# EAGLE schematic Mouse-Schematic copy (EAGLE 9.6.2)
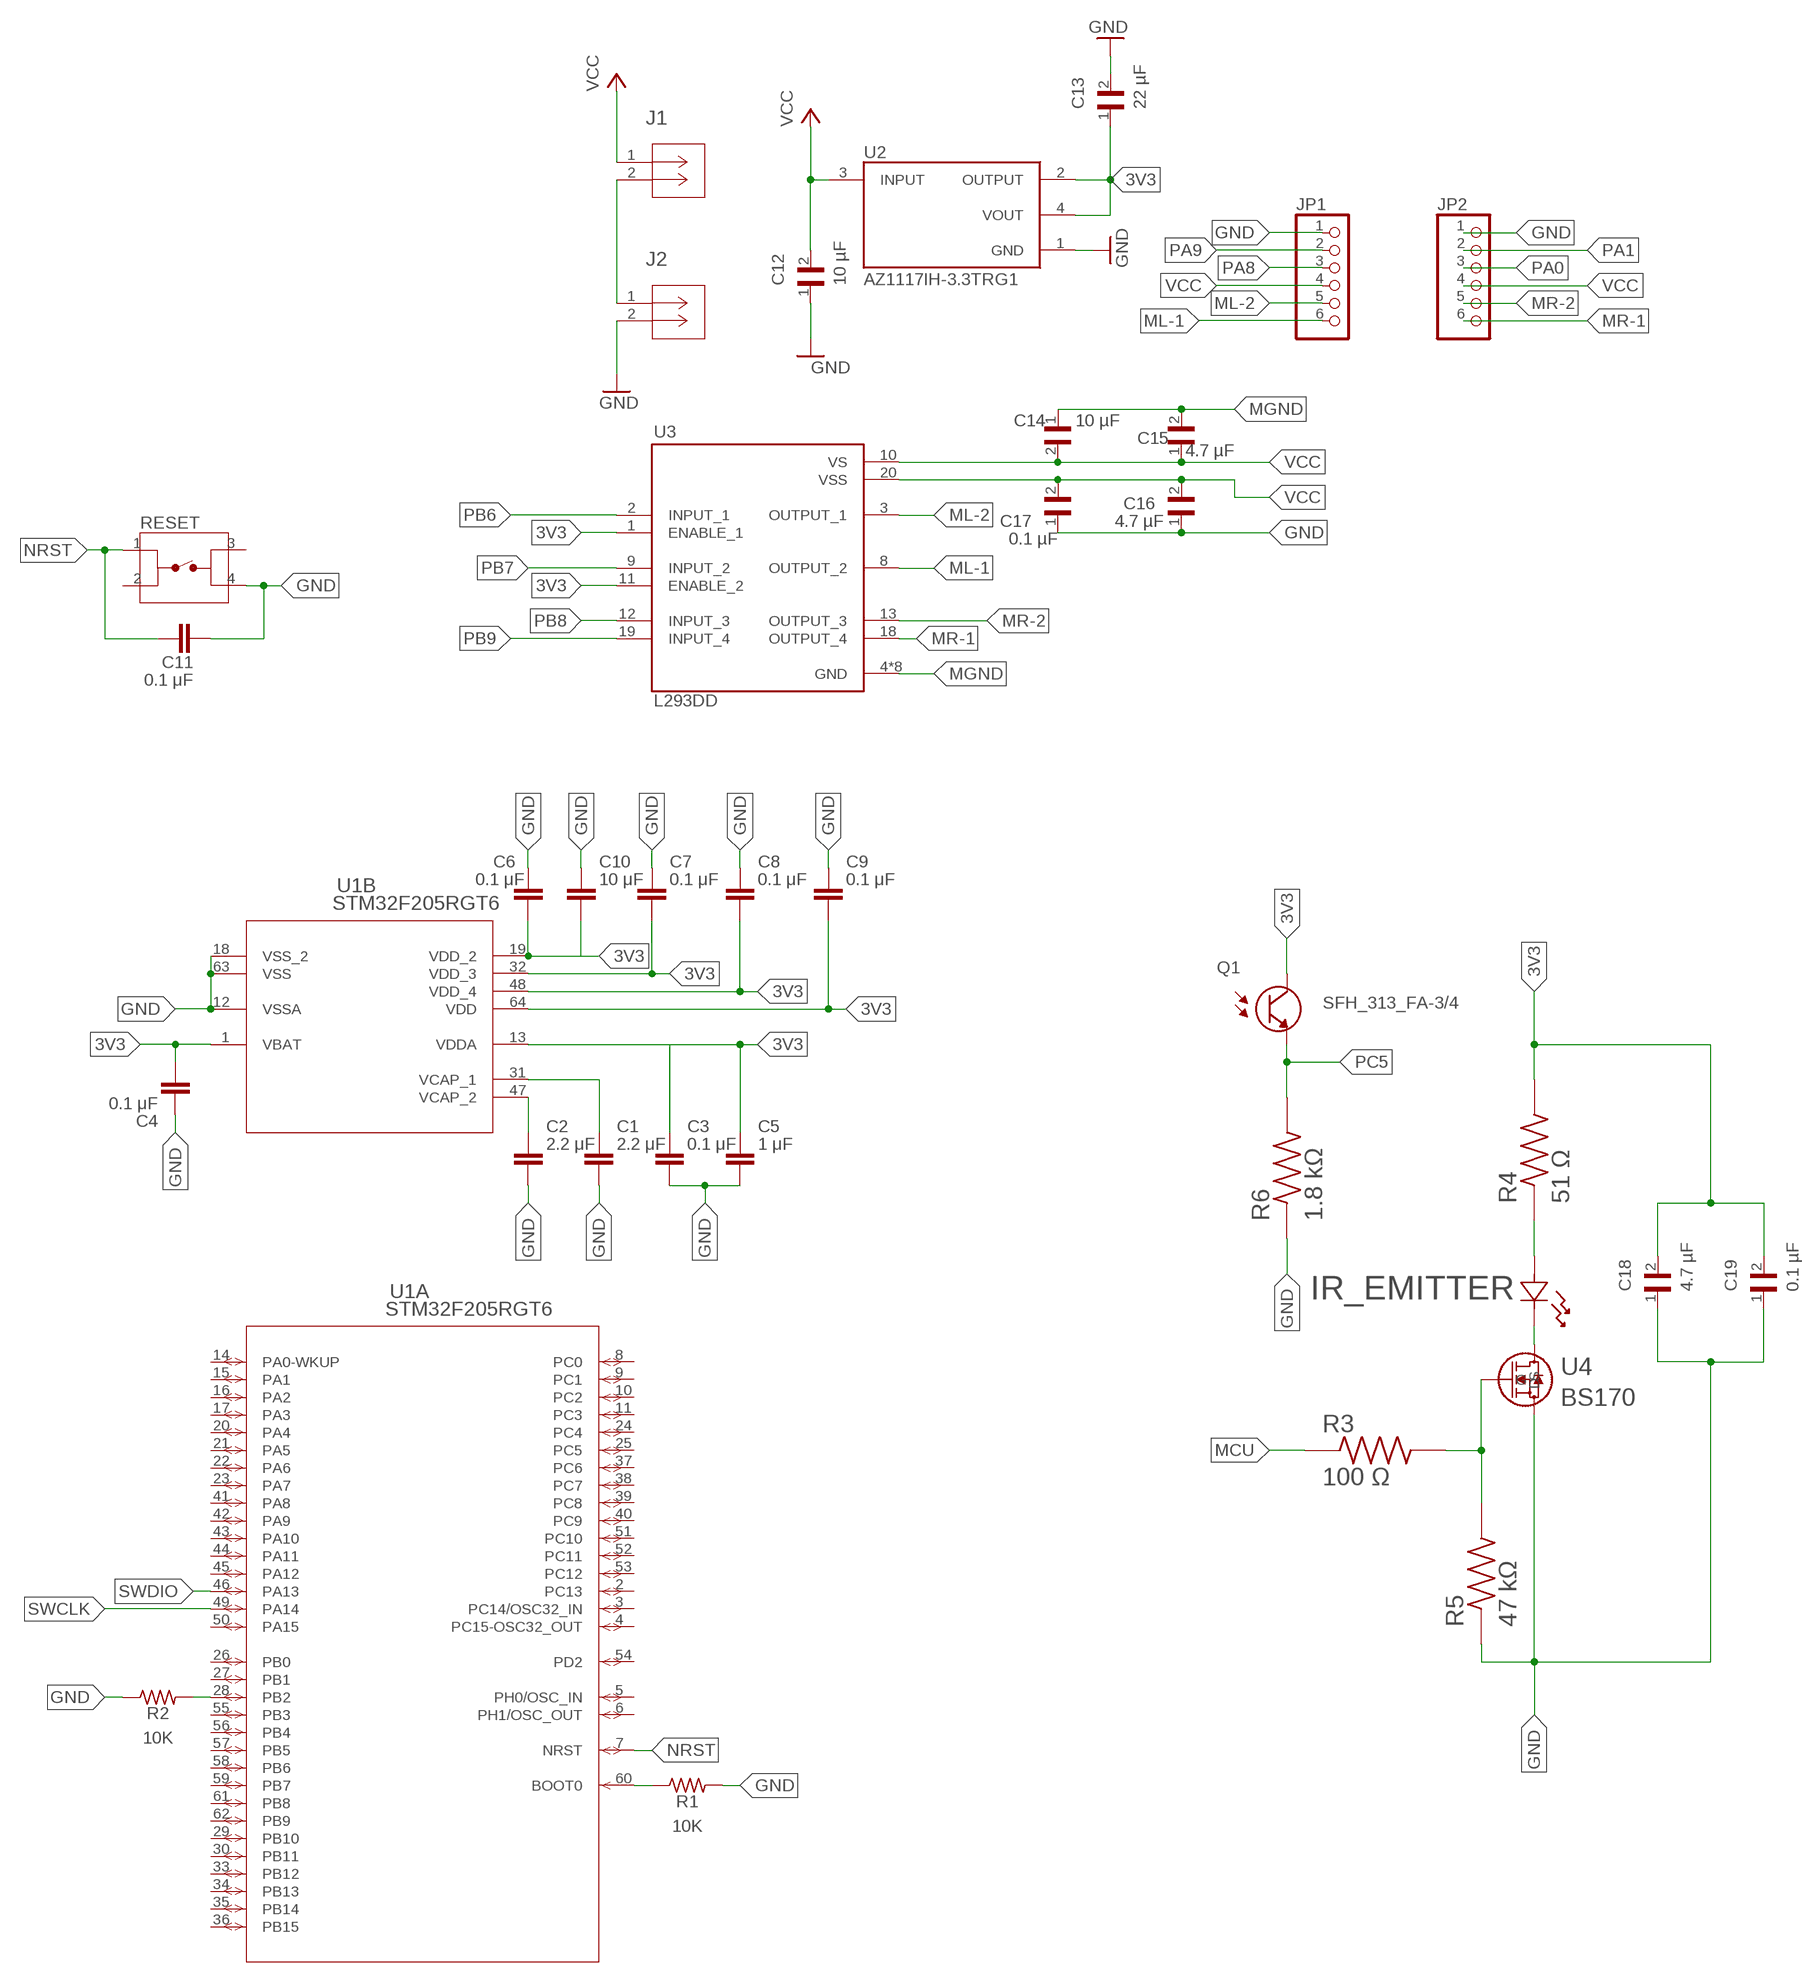
[diagram p0: schematic, sheet 1]

## Parts
C1  2.2 μF  C_CHIP-0603(1608-METRIC)  [CAPC1608X85]
C2  2.2 μF  C_CHIP-0603(1608-METRIC)  [CAPC1608X85]
C3  0.1 μF  C_CHIP-0603(1608-METRIC)  [CAPC1608X85]
C4  0.1 μF  C_CHIP-0603(1608-METRIC)  [CAPC1608X85]
C5  1 μF  C_CHIP-0603(1608-METRIC)  [CAPC1608X85]
C6  0.1 μF  C_CHIP-0603(1608-METRIC)  [CAPC1608X85]
C7  0.1 μF  C_CHIP-0603(1608-METRIC)  [CAPC1608X85]
C8  0.1 μF  C_CHIP-0603(1608-METRIC)  [CAPC1608X85]
C9  0.1 μF  C_CHIP-0603(1608-METRIC)  [CAPC1608X85]
C10  10 μF  C_CHIP-0603(1608-METRIC)  [CAPC1608X85]
C11  0.1 μF  C_CHIP-0603(1608-METRIC)  [CAPC1608X85]
C12  10 µF  GRM21BR61C106KE15L  [CAPC2012X135N]
C13  22 µF  GRM21BR61C226ME44L  [CAPC2012X145N]
C14  10 µF  GRM21BR61C106KE15L  [CAPC2012X135N]
C15  4.7 µF  GRM21BR71C475KE51L  [CAPC2012X140N]
C16  4.7 µF  GRM21BR71C475KE51L  [CAPC2012X140N]
C17  0.1 µF  GCM21BR72A104KA37K  [CAPC2012X140N]
C18  4.7 µF  GRM21BR71C475KE51L  [CAPC2012X140N]
C19  0.1 µF  GCM21BR72A104KA37K  [CAPC2012X140N]
J1  B2B-PH-K-S  [CONN2_B2B-PH-K-S_JST]
J2  B2B-PH-K-S  [CONN2_B2B-PH-K-S_JST]
JP1  PINHD-1X6  [1X06]
JP2  PINHD-1X6  [1X06]
LED1  IR_EMITTER  INL-5AMIR15  [LED_INL-5AMIR15_INO]
Q1  SFH_313_FA-3/4  [XDCR_SFH_313_FA-3/4]
R1  10K  R-US_CHIP-0603(1608-METRIC)  [RESC1608X60]
R2  10K  R-US_CHIP-0603(1608-METRIC)  [RESC1608X60]
R3  100 Ω  CRCW0805100RFKEAHP  [RESC2012X60N]
R4  51 Ω  CRCW080551R0FKEAHP  [RESC2012X60N]
R5  47 kΩ  CRCW080547K0JNEA  [RESC2012X50N]
R6  1.8 kΩ  CRCW08051K80FKEB  [RESC2012X50N]
RESET  FSM4JSMA  [TE_FSM4JSMA]
U1  STM32F205RGT6  [LQFP64-10X10MM]
U2  AZ1117IH-3.3TRG1  [SOT230P700X185-4N]
U3  L293DD  [SOIC127P1032X265-20N]
U4  BS170  [TO_SA06_ONS]

## Nets
3V3: C3.1 C4.2 C5.1 C6.2 C7.2 C8.2 C9.2 C10.2 C13.1 C18.2 C19.2 Q1.2(C) R4.2 U1.1(B:VBAT) U1.13(B:VDDA) U1.19(B:VDD_2) U1.32(B:VDD_3) U1.48(B:VDD_4) U1.64(B:VDD) U2.2(OUTPUT) U2.4(VOUT) U3.1(ENABLE_1) U3.11(ENABLE_2)
GND: C1.2 C2.2 C3.2 C4.1 C5.2 C6.1 C7.1 C8.1 C9.1 C10.1 C11.2 C12.1 C13.2 C16.1 C17.1 C18.1 C19.1 J2.2 JP1.1 JP2.1 R1.2 R2.1 R5.1 R6.1 RESET.4 U1.12(B:VSSA) U1.18(B:VSS_2) U1.63(B:VSS) U2.1(GND) U4.3(S)
MCU: R3.1
MGND: C14.1 C15.2 U3.4(GND) U3.5(GND) U3.6(GND) U3.7(GND) U3.14(GND) U3.15(GND) U3.16(GND) U3.17(GND)
ML-1: JP1.6 U3.8(OUTPUT_2)
ML-2: JP1.5 U3.3(OUTPUT_1)
MR-1: JP2.6 U3.18(OUTPUT_4)
MR-2: JP2.5 U3.13(OUTPUT_3)
N$1: C1.1 U1.31(B:VCAP_1)
N$2: C2.1 U1.47(B:VCAP_2)
N$3: R1.1 U1.60(A:BOOT0)
N$4: R2.2 U1.28(A:PB2)
N$5: J1.2 J2.1
N$6: R3.2 R5.2 U4.1(G)
N$7: LED1.1 U4.2(D)
N$8: LED1.2 R4.1
NRST: C11.1 RESET.1 U1.7(A:NRST)
PA0: JP2.3
PA1: JP2.2
PA8: JP1.3
PA9: JP1.2
PB6: U3.2(INPUT_1)
PB7: U3.9(INPUT_2)
PB8: U3.12(INPUT_3)
PB9: U3.19(INPUT_4)
PC5: Q1.1(E) R6.2
SWCLK: U1.49(A:PA14)
SWDIO: U1.46(A:PA13)
VCC: C12.2 C14.2 C15.1 C16.2 C17.2 J1.1 JP1.4 JP2.4 U2.3(INPUT) U3.10(VS) U3.20(VSS)
Unconnected: RESET.2 RESET.3 U1.2(A:PC13) U1.3(A:PC14/OSC32_IN) U1.4(A:PC15-OSC32_OUT) U1.5(A:PH0/OSC_IN) U1.6(A:PH1/OSC_OUT) U1.8(A:PC0) U1.9(A:PC1) U1.10(A:PC2) U1.11(A:PC3) U1.14(A:PA0-WKUP) U1.15(A:PA1) U1.16(A:PA2) U1.17(A:PA3) U1.20(A:PA4) U1.21(A:PA5) U1.22(A:PA6) U1.23(A:PA7) U1.24(A:PC4) U1.25(A:PC5) U1.26(A:PB0) U1.27(A:PB1) U1.29(A:PB10) U1.30(A:PB11) U1.33(A:PB12) U1.34(A:PB13) U1.35(A:PB14) U1.36(A:PB15) U1.37(A:PC6) U1.38(A:PC7) U1.39(A:PC8) U1.40(A:PC9) U1.41(A:PA8) U1.42(A:PA9) U1.43(A:PA10) U1.44(A:PA11) U1.45(A:PA12) U1.50(A:PA15) U1.51(A:PC10) U1.52(A:PC11) U1.53(A:PC12) U1.54(A:PD2) U1.55(A:PB3) U1.56(A:PB4) U1.57(A:PB5) U1.58(A:PB6) U1.59(A:PB7) U1.61(A:PB8) U1.62(A:PB9)

## Library data of the parts
C1-C6 = Capacitor:C: Capacitor - Generic; CATEGORY: Capacitor
C7-C11 = Capacitor2:C: Capacitor - Generic; CATEGORY: Capacitor
C12 C14 = GRM21BR61C106KE15L:GRM21BR61C106KE15L; CHECK_PRICES: https://www.snapeda.com/parts/GRM21BR61C106KE15L/Murata+Electronics+North+America/view-part/?ref=eda; DESCRIPTION: 10 µF ±10% 16V Ceramic Capacitor X5R 0805 (2012 Metric); MF: Murata; MP: GRM21BR61C106KE15L; PACKAGE: 2012 Murata; PURCHASE-URL: https://www.snapeda.com/api/url_track_click_mouser/?unipart_id=78773&manufacturer=Murata&part_name=GRM21BR61C106KE15L&search_term=None; SNAPEDA_LINK: https://www.snapeda.com/parts/GRM21BR61C106KE15L/Murata+Electronics+North+America/view-part/?ref=snap
C13 = GRM21BR61C226ME44L:GRM21BR61C226ME44L; CHECK_PRICES: https://www.snapeda.com/parts/GRM21BR61C226ME44L/Murata+Electronics+North+America/view-part/?ref=eda; DESCRIPTION: 22 µF ±20% 16V Ceramic Capacitor X5R 0805 (2012 Metric); MF: Murata; MP: GRM21BR61C226ME44L; PACKAGE: 2012 Murata; PURCHASE-URL: https://www.snapeda.com/api/url_track_click_mouser/?unipart_id=1755529&manufacturer=Murata&part_name=GRM21BR61C226ME44L&search_term=None; SNAPEDA_LINK: https://www.snapeda.com/parts/GRM21BR61C226ME44L/Murata+Electronics+North+America/view-part/?ref=snap
C15 C16 C18 = GRM21BR71C475KE51L:GRM21BR71C475KE51L: SMD Capacitor X7R(EIA) with Capacitance: 4.7uF Tol. 10%. Rated Voltage: 16Vdc; CHECK_PRICES: https://www.snapeda.com/parts/GRM21BR71C475KE51L/Murata/view-part/?ref=eda; DESCRIPTION: 4.7 µF ±10% 16V Ceramic Capacitor X7R 0805 (2012 Metric); DIGIKEY_PART_NUMBER: 490-14466-2-ND; MF: Murata Electronics; MP: GRM21BR71C475KE51L; PACKAGE: 0805 Murata Electronics; PURCHASE-URL: https://www.snapeda.com/api/url_track_click_mouser/?unipart_id=5514957&manufacturer=Murata Electronics&part_name=GRM21BR71C475KE51L&search_term=None; SNAPEDA_LINK: https://www.snapeda.com/parts/GRM21BR71C475KE51L/Murata/view-part/?ref=snap
C17 C19 = GCM21BR72A104KA37K:GCM21BR72A104KA37K; CHECK_PRICES: https://www.snapeda.com/parts/GCM21BR72A104KA37K/Murata+Electronics+North+America/view-part/?ref=eda; DESCRIPTION: 0.1 µF ±10% 100V Ceramic Capacitor X7R 0805 (2012 Metric); MF: Murata; MP: GCM21BR72A104KA37K; PACKAGE: 2012 Murata; PURCHASE-URL: https://www.snapeda.com/api/url_track_click_mouser/?unipart_id=1756077&manufacturer=Murata&part_name=GCM21BR72A104KA37K&search_term=None; SNAPEDA_LINK: https://www.snapeda.com/parts/GCM21BR72A104KA37K/Murata+Electronics+North+America/view-part/?ref=snap
J1 J2 = 2 Pin JST Connector:B2B-PH-K-S; COPYRIGHT: Copyright (C) 2023 Ultra Librarian. All rights reserved.; DIGIKEY_PART_NUMBER_1: 455-1262-ND; MANUFACTURER_PART_NUMBER: B2B-PH-K-S; MFR_NAME: JST
JP1 JP2 = pinhead:PINHD-1X6: PIN HEADER
LED1 = IR_Emitter:INL-5AMIR15; COPYRIGHT: Copyright (C) 2024 Ultra Librarian. All rights reserved.; DIGIKEY_PART_NUMBER_1: 1830-INL-5AMIR15-ND; MANUFACTURER_PART_NUMBER: INL-5AMIR15; MFR_NAME: Inolux
Q1 = SFH_313_FA-3_4:SFH_313_FA-3/4: Phototransistor IR Chip Silicon 870nm 2-Pin T-1 3/4; CHECK_PRICES: https://www.snapeda.com/parts/SFH%20313%20FA-3/4/OSRAM+Opto+Semiconductors+Inc./view-part/?ref=eda; DESCRIPTION: Phototransistors 870nm Top View Radial - 2 Leads; DIGIKEY_PART_NUMBER: 475-SFH313FA-3/4-ND; MF: OSRAM Opto; MP: SFH 313 FA-3/4; PACKAGE: Radial-2 OSRAM Opto; SNAPEDA_LINK: https://www.snapeda.com/parts/SFH%20313%20FA-3/4/OSRAM+Opto+Semiconductors+Inc./view-part/?ref=snap
R1 R2 = Resistor2:R-US: Resistor Fixed - ANSI; CATEGORY: Resistor; SUB-CATEGORY: Fixed
R3 = CRCW0805100RFKEAHP:CRCW0805100RFKEAHP: CRCW0805-HP 100 100R 1% ET1 E3; CHECK_PRICES: https://www.snapeda.com/parts/CRCW0805100RFKEAHP/Vishay+Dale/view-part/?ref=eda; DESCRIPTION: Resistor;Thick Film;100 Ohms;0.33 W;1%;SMT;0805;TCR 37 ppm/DegC | Vishay Dale CRCW0805100RFKEAHP; DIGIKEY_PART_NUMBER: 541-100TTR-ND; MF: Vishay; MP: CRCW0805100RFKEAHP; PACKAGE: 2012 Bourns; PURCHASE-URL: https://www.snapeda.com/api/url_track_click_mouser/?unipart_id=984567&manufacturer=Vishay&part_name=CRCW0805100RFKEAHP&search_term=None; SNAPEDA_LINK: https://www.snapeda.com/parts/CRCW0805100RFKEAHP/Vishay+Dale/view-part/?ref=snap
R4 = CRCW080551R0FKEAHP:CRCW080551R0FKEAHP; CHECK_PRICES: https://www.snapeda.com/parts/CRCW080551R0FKEAHP/Vishay/view-part/?ref=eda; DESCRIPTION: Resistor;Thick Film;51 Ohms;0.33 W;1%;SMT;0805;TCR 37 ppm/DegC | Vishay Dale CRCW080551R0FKEAHP; DIGIKEY_PART_NUMBER: 541-51.0TTR-ND; MF: Vishay; MP: CRCW080551R0FKEAHP; PACKAGE: 2012 Bourns; SNAPEDA_LINK: https://www.snapeda.com/parts/CRCW080551R0FKEAHP/Vishay/view-part/?ref=snap
R5 = CRCW080547K0JNEA:CRCW080547K0JNEA: Resistor; Thick Film; 47 Kilohms; 0.125 W; 5%; SMT; 0805; TCR 73 ppm/DegC; Tape and Reel; CHECK_PRICES: https://www.snapeda.com/parts/CRCW080547K0JNEA/Vishay+Dale/view-part/?ref=eda; DESCRIPTION: Resistor,Thick Film,47 Kilohms,0.125 W,5%,SMT,0805,TCR 73 ppm/DegC,Cut Tape | Vishay Dale CRCW080547K0JNEA; DIGIKEY_PART_NUMBER: 541-47KATR-ND; MF: Vishay Dale; MP: CRCW080547K0JNEA; PACKAGE: 2012 Vishay; PURCHASE-URL: https://www.snapeda.com/api/url_track_click_mouser/?unipart_id=614704&manufacturer=Vishay Dale&part_name=CRCW080547K0JNEA&search_term=None; SNAPEDA_LINK: https://www.snapeda.com/parts/CRCW080547K0JNEA/Vishay+Dale/view-part/?ref=snap
R6 = CRCW08051K80FKEB:CRCW08051K80FKEB: RES SMD 1.8K OHM 1% 1/8W 0805; CHECK_PRICES: https://www.snapeda.com/parts/CRCW08051K80FKEB/Vishay+Dale/view-part/?ref=eda; DESCRIPTION: 1.8 kOhms ±1% 0.125W, 1/8W Chip Resistor 0805 (2012 Metric) Automotive AEC-Q200 Thick Film; DIGIKEY_PART_NUMBER: 541-CRCW08051K80FKEBTR-ND; MF: Vishay Dale; MP: CRCW08051K80FKEB; PACKAGE: 2012 Vishay; PURCHASE-URL: https://www.snapeda.com/api/url_track_click_mouser/?unipart_id=943539&manufacturer=Vishay Dale&part_name=CRCW08051K80FKEB&search_term=None; SNAPEDA_LINK: https://www.snapeda.com/parts/CRCW08051K80FKEB/Vishay+Dale/view-part/?ref=snap
RESET = FSM4JSMA:FSM4JSMA: Switch Tactile OFF (ON) SPST Round Button Gull Wing 0.05A 24VDC 2.6N SMD T/R; COMMENT: 4-1437565-1; CONFIGURATION_POLE-THROW: Single Pole - Single Throw; CONTACT_CURRENT_RATING: 50 mA; DESCRIPTION: Tactile Switch SPST-NO Top Actuated Surface Mount; DIGI-KEY_PART_NUMBER: 450-1759-2-ND; EU_ROHS_COMPLIANCE: Compliant; MF: TE Connectivity; MP: FSM4JSMA; PACKAGE: None; PURCHASE-URL: https://pricing.snapeda.com/search/part/FSM4JSMA/?ref=eda
U1 = stm32f205rgt6:STM32F205RGT6; COPYRIGHT: Copyright (C) 2021 Ultra Librarian. All rights reserved.; MANUFACTURER_PART_NUMBER: STM32F205RGT6; MFR_NAME: STMicroelectronics
U2 = AZ1117IH-3.3TRG1:AZ1117IH-3.3TRG1: Check availability <https://pricing.snapeda.com/parts/AZ1117IH-3.3TRG1/Diodes%20Inc./view-part?ref=eda>; AVAILABILITY: In Stock; CHECK_PRICES: https://www.snapeda.com/parts/AZ1117IH-3.3TRG1/Diodes+Inc./view-part/?ref=eda; DESCRIPTION: Linear Voltage Regulator IC Positive Fixed 1 Output 1A SOT-223-3; MF: Diodes Inc.; MP: AZ1117IH-3.3TRG1; PACKAGE: SOT-223 Diodes Inc.; PRICE: None; PURCHASE-URL: https://www.snapeda.com/api/url_track_click_mouser/?unipart_id=490259&manufacturer=Diodes Inc.&part_name=AZ1117IH-3.3TRG1&search_term=az1117ih-3.3trg1; SNAPEDA_LINK: https://www.snapeda.com/parts/AZ1117IH-3.3TRG1/Diodes+Inc./view-part/?ref=snap
U3 = L293DD:L293DD: L293DD Series Push - Pull Quad Channel Driver with Diodes - SOIC-20; CHECK_PRICES: https://www.snapeda.com/parts/L293DD/STMicroelectronics/view-part/?ref=eda; DESCRIPTION: Bipolar Motor Driver Parallel 20-SOIC; DIGIKEY_PART_NUMBER: 497-1390-5-ND; MF: STMicroelectronics; MP: L293DD; PACKAGE: SOIC-20 STMicroelectronics; PURCHASE-URL: https://www.snapeda.com/api/url_track_click_mouser/?unipart_id=48952&manufacturer=STMicroelectronics&part_name=L293DD&search_term=None; SNAPEDA_LINK: https://www.snapeda.com/parts/L293DD/STMicroelectronics/view-part/?ref=snap
U4 = MOSFET:BS170; COPYRIGHT: Copyright (C) 2024 Ultra Librarian. All rights reserved.; DIGIKEY_PART_NUMBER_1: 2156-BS170-ND; DIGIKEY_PART_NUMBER_2: 2156-BS170-OS-ND; DIGIKEY_PART_NUMBER_3: 2368-BS170-ND; DIGIKEY_PART_NUMBER_4: BS170-ND; DIGIKEY_PART_NUMBER_5: BS170DICT-ND; DIGIKEY_PART_NUMBER_6: BS170DITB-ND; DIGIKEY_PART_NUMBER_7: BS170OS-ND; MANUFACTURER_PART_NUMBER: BS170; MFR_NAME: onsemi